# EAGLE schematic 04C-11 (EAGLE 6.3)
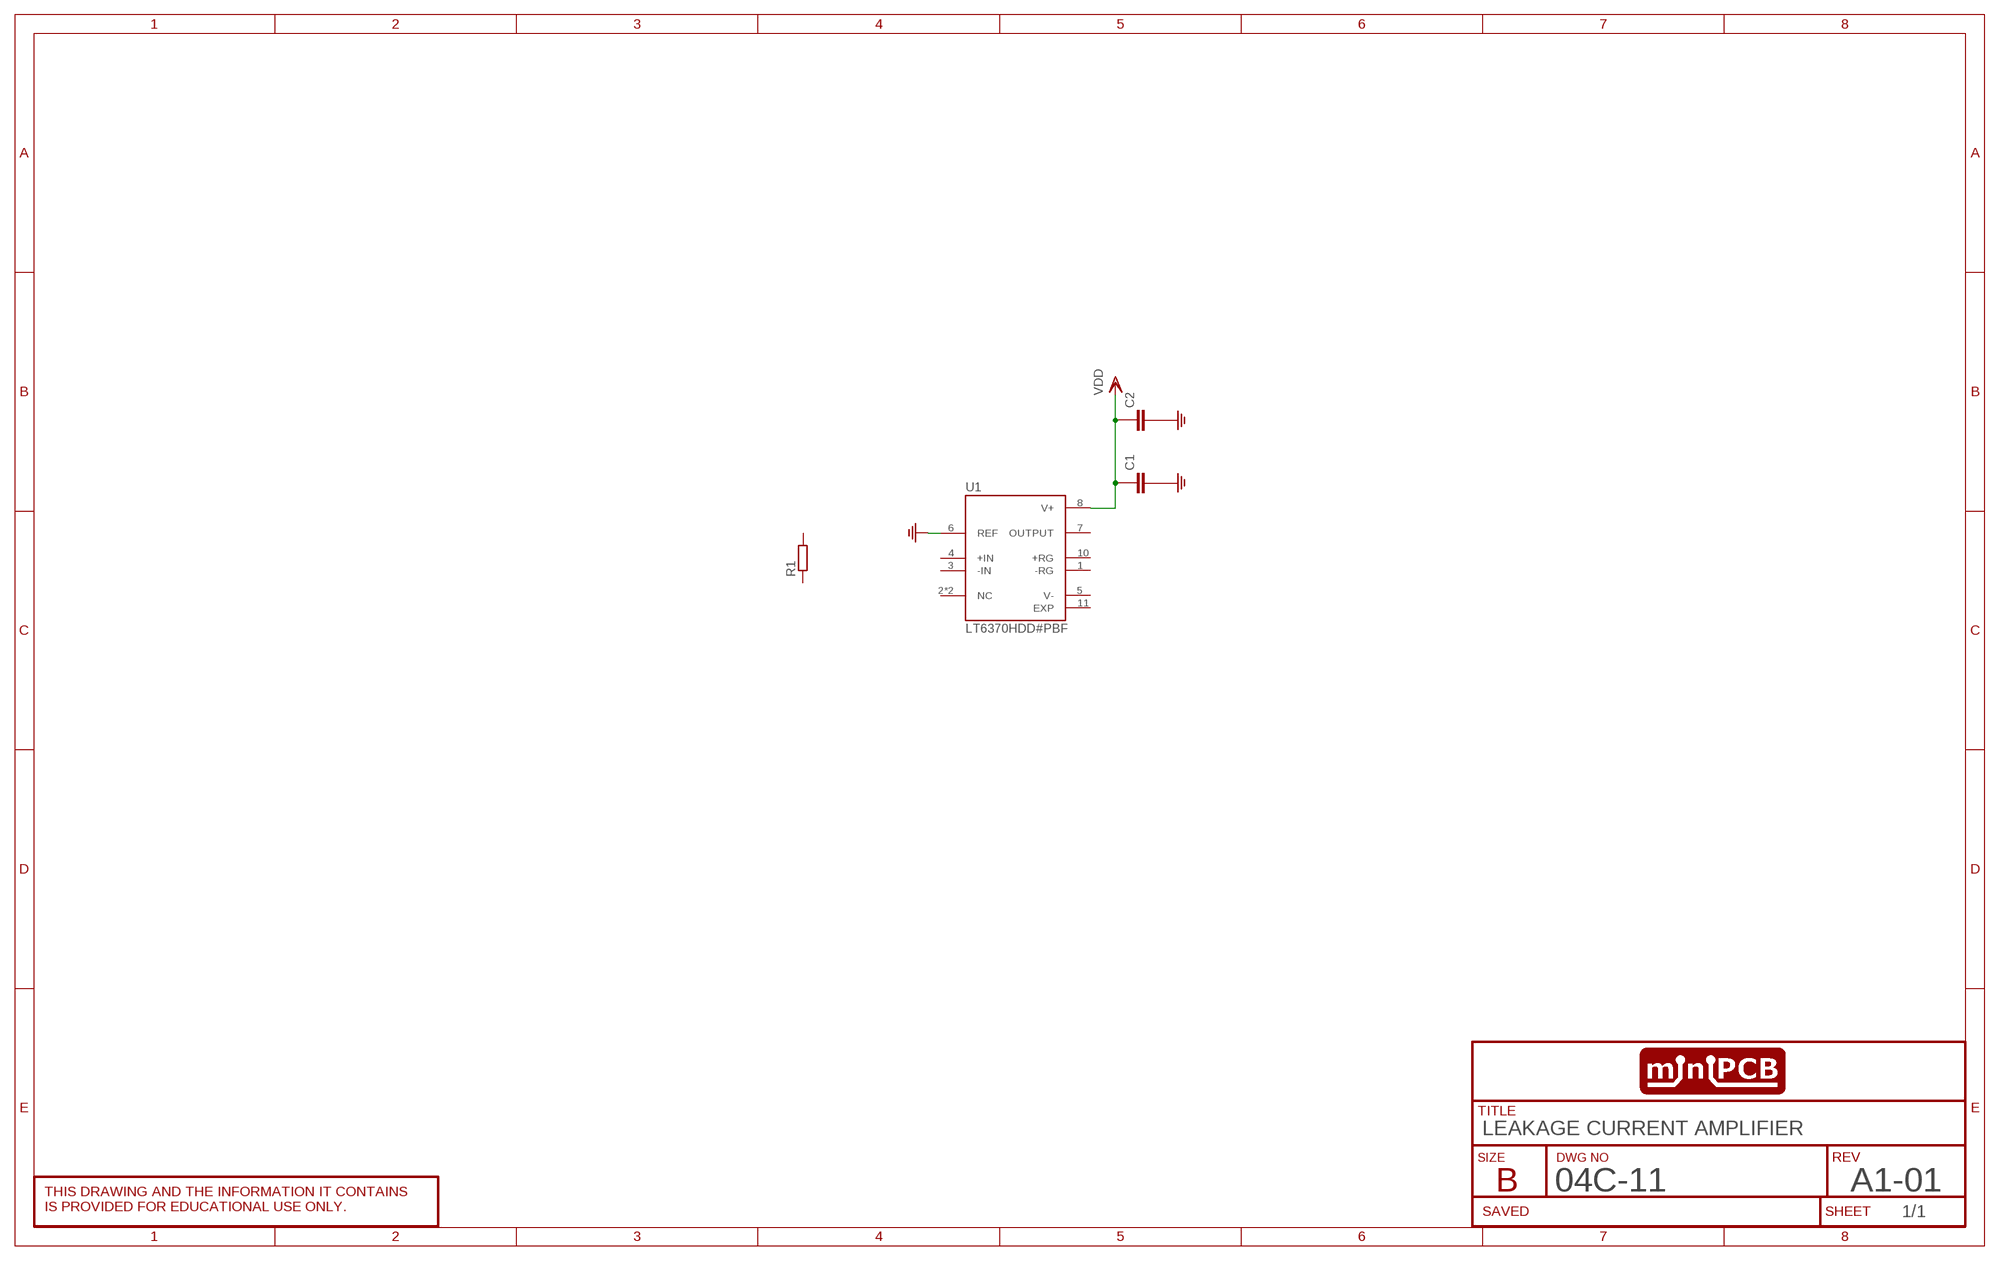
[diagram p0: schematic, sheet 1]
SHEET1 (SCHEMATIC): DWG_NO: 04C-11; REV: A1-01; TITLE: LEAKAGE CURRENT AMPLIFIER

## Parts
C1  CAPACITOR0402  [C0402]
C2  CAPACITOR0402  [C0402]
R1  RESISTORSMD  [R0805]
U1  LT6370HDD#PBF  [SON50P300X300X80-11N]

## Nets
GND: C1.2(-) C2.2(-) U1.6(REF)
VDD: C1.1(+) C2.1(+) U1.8(V+)
Unconnected: R1.1 R1.2 U1.1(-RG) U1.2(NC) U1.3(-IN) U1.4(+IN) U1.7(OUTPUT) U1.9(NC) U1.10(+RG) U1.11(EXP)

## Power pins joined to a net without a drawn wire
V-: U1.5(V-)

## Library data of the parts
C1 C2 = minipcb:CAPACITOR
R1 = minipcb:RESISTOR
U1 = minipcb:LT6370HDD#PBF: Check availability <https://pricing.snapeda.com/parts/LT6370HDD%23PBF/Analog%20Devices/view-part?ref=eda>; AVAILABILITY: In Stock; CHECK_PRICES: https://www.snapeda.com/parts/LT6370HDD%23PBF/Analog+Devices/view-part/?ref=eda; DESCRIPTION: 25µV, 0.3µV/°C, Low Noise Instrumentation Amplifier; MF: Analog Devices; MP: LT6370HDD#PBF; PACKAGE: DFN -10 Analog Devices; PRICE: None; SNAPEDA_LINK: https://www.snapeda.com/parts/LT6370HDD%23PBF/Analog+Devices/view-part/?ref=snap